# Altium schematic sheet STM32.SchDoc
size A3
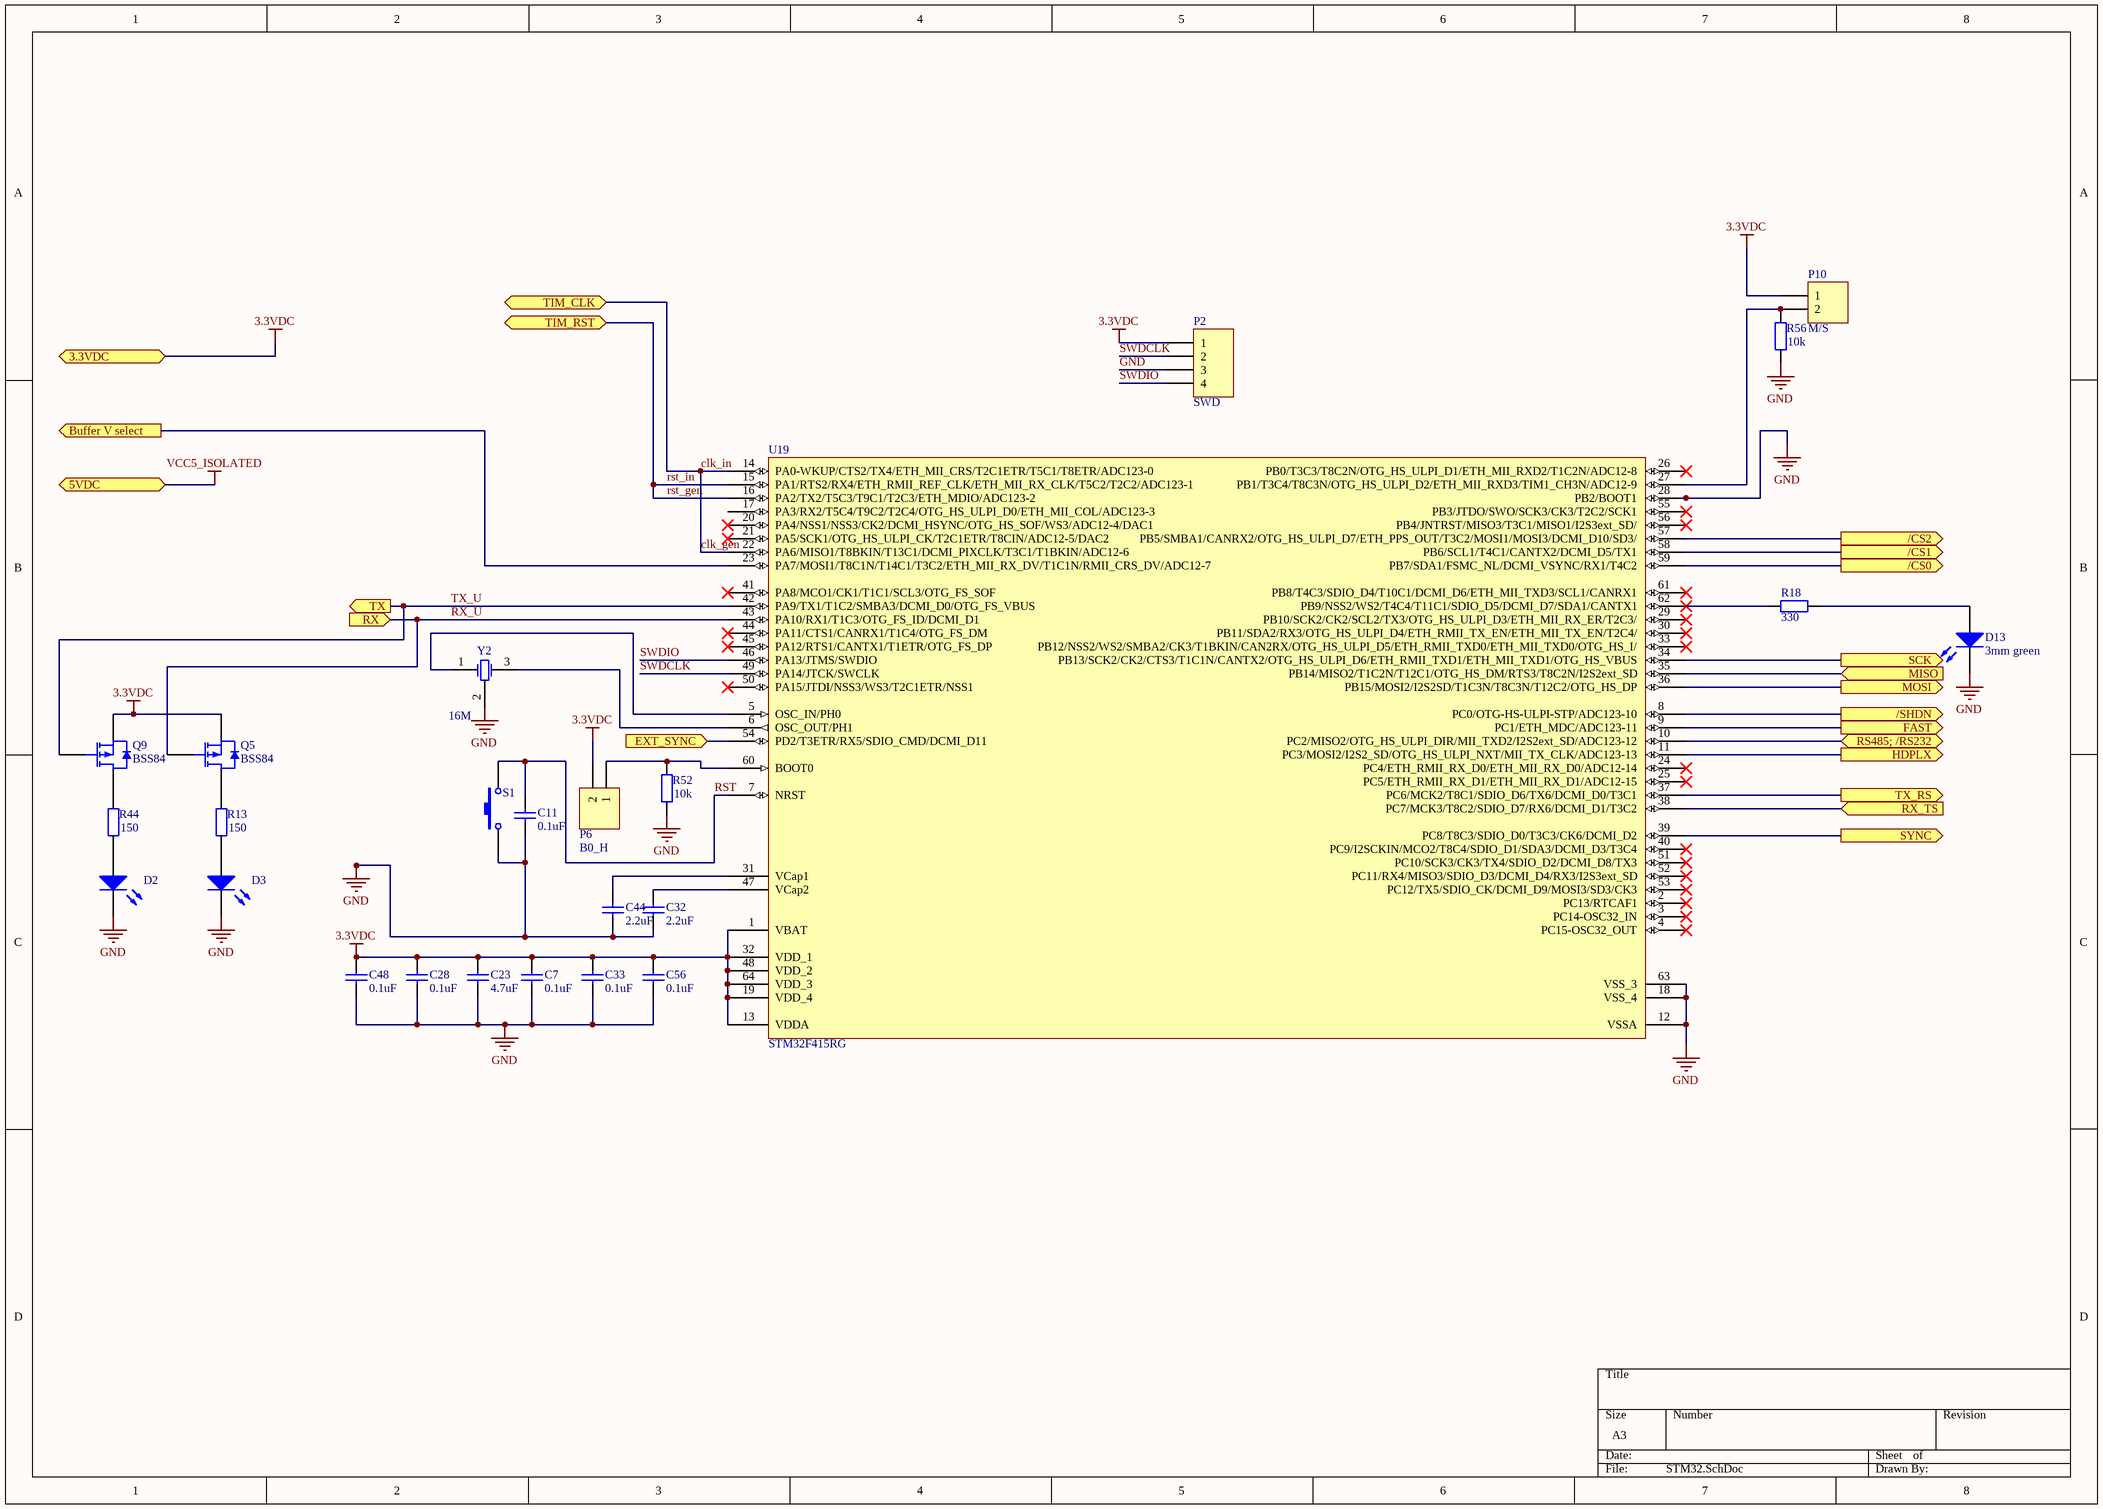
[diagram p0: STM32.SchDoc]

## Parts
C7  value 0.1uF  [C_0603]  (hidden comment: Cap)
C11  value 0.1uF  [C_0603]  (hidden comment: Cap)
C23  value 4.7uF  [C_0603]  (hidden comment: Cap)
C28  value 0.1uF  [C_0603]  (hidden comment: Cap)
C32  value 2.2uF  [C_0603]  (hidden comment: Cap)
C33  value 0.1uF  [C_0603]  (hidden comment: Cap)
C44  value 2.2uF  [C_0603]  (hidden comment: Cap)
C48  value 0.1uF  [C_0603]  (hidden comment: Cap)
C56  value 0.1uF  [C_0603]  (hidden comment: Cap)
D2  3mm led yellow  [Led, 2.54mm pitch]  (value not drawn)
D3  3mm red  [Led, 2.54mm pitch]  (value not drawn)
D13  3mm green  [Led, 2.54mm pitch]
P2  SWD  [HDR1X4]
P6  B0_H  [HDR1X2]
P10  M/S  [HDR1X2]
Q5  BSS84  [SOT23_N]
Q9  BSS84  [SOT23_N]
R13  value 150  [R_0603]  (hidden comment: Res)
R18  value 330  [R_0603]  (hidden comment: Res)
R44  value 150  [R_0603]  (hidden comment: Res)
R52  value 10k  [R_0603]  (hidden comment: Res)
R56  value 10k  [R_0603]  (hidden comment: Res)
S1  RST  [SPST_4DIP]  (value not drawn)
U19  STM32F415RG  [LQFP64]
Y2  value 16M  [XTAL16MHz]  (hidden comment: Murata XTAL)

## Ports
3.3VDC, 5VDC, /CS0 (out), /CS1 (out), /CS2 (out), /SHDN (out), Buffer V select (out), EXT_SYNC (in), FAST (out), HDPLX (out), MISO (in), MOSI (out), RS485; /RS232, RX (in), RX_TS (in), SCK (out), SYNC (out), TIM_CLK, TIM_RST, TX (out), TX_RS (out)

## Nets
3.3VDC: C7.2 C23.2 C28.2 C33.2 C48.2 C56.2 P2.1 P6.2 P10.1 Q5.2(S) Q9.2(S) U19.1(VBAT) U19.13(VDDA) U19.19(VDD_4) U19.32(VDD_1) U19.48(VDD_2) U19.64(VDD_3) ; port 3.3VDC
GND: C7.1 C11.1 C23.1 C28.1 C32.1 C33.1 C44.1 C48.1 C56.1 D2.2(K) D3.2(K) D13.2(K) P2.3 R52.1 R56.1 S1.1 U19.12(VSSA) U19.18(VSS_4) U19.28(PB2/BOOT1) U19.63(VSS_3) Y2.2
VCC5_ISOLATED: port 5VDC
/CS0: U19.59(PB7/SDA1/FSMC_NL/DCMI_VSYNC/RX1/T4C2) ; port /CS0
/CS1: U19.58(PB6/SCL1/T4C1/CANTX2/DCMI_D5/TX1) ; port /CS1
/CS2: U19.57(PB5/SMBA1/CANRX2/OTG_HS_ULPI_D7/ETH_PPS_OUT/T3C2/MOSI1/MOSI3/DCMI_D10/SD3/) ; port /CS2
/SHDN: U19.8(PC0/OTG-HS-ULPI-STP/ADC123-10) ; port /SHDN
Buffer V select: U19.23(PA7/MOSI1/T8C1N/T14C1/T3C2/ETH_MII_RX_DV/T1C1N/RMII_CRS_DV/ADC12-7) ; port Buffer V select
clk_gen: U19.14(PA0-WKUP/CTS2/TX4/ETH_MII_CRS/T2C1ETR/T5C1/T8ETR/ADC123-0) U19.22(PA6/MISO1/T8BKIN/T13C1/DCMI_PIXCLK/T3C1/T1BKIN/ADC12-6) ; port TIM_CLK  [also labelled clk_in]
EXT_SYNC: U19.54(PD2/T3ETR/RX5/SDIO_CMD/DCMI_D11) ; port EXT_SYNC
FAST: U19.9(PC1/ETH_MDC/ADC123-11) ; port FAST
HDPLX: U19.11(PC3/MOSI2/I2S2_SD/OTG_HS_ULPI_NXT/MII_TX_CLK/ADC123-13) ; port HDPLX
MISO: U19.35(PB14/MISO2/T1C2N/T12C1/OTG_HS_DM/RTS3/T8C2N/I2S2ext_SD) ; port MISO
MOSI: U19.36(PB15/MOSI2/I2S2SD/T1C3N/T8C3N/T12C2/OTG_HS_DP) ; port MOSI
RS485; /RS232: U19.10(PC2/MISO2/OTG_HS_ULPI_DIR/MII_TXD2/I2S2ext_SD/ADC123-12) ; port RS485; /RS232
RST: C11.2 S1.2 U19.7(NRST)
rst_gen: U19.15(PA1/RTS2/RX4/ETH_RMII_REF_CLK/ETH_MII_RX_CLK/T5C2/T2C2/ADC123-1) U19.16(PA2/TX2/T5C3/T9C1/T2C3/ETH_MDIO/ADC123-2) ; port TIM_RST  [also labelled rst_in]
RX_TS: U19.38(PC7/MCK3/T8C2/SDIO_D7/RX6/DCMI_D1/T3C2) ; port RX_TS
RX_U: Q5.1(G) U19.43(PA10/RX1/T1C3/OTG_FS_ID/DCMI_D1) ; port RX
SCK: U19.34(PB13/SCK2/CK2/CTS3/T1C1N/CANTX2/OTG_HS_ULPI_D6/ETH_RMII_TXD1/ETH_MII_TXD1/OTG_HS_VBUS) ; port SCK
SWDCLK: P2.2 U19.49(PA14/JTCK/SWCLK)
SWDIO: P2.4 U19.46(PA13/JTMS/SWDIO)
SYNC: U19.39(PC8/T8C3/SDIO_D0/T3C3/CK6/DCMI_D2) ; port SYNC
TX_RS: U19.37(PC6/MCK2/T8C1/SDIO_D6/TX6/DCMI_D0/T3C1) ; port TX_RS
TX_U: Q9.1(G) U19.42(PA9/TX1/T1C2/SMBA3/DCMI_D0/OTG_FS_VBUS) ; port TX
NetC32_2: C32.2 U19.47(VCap2)
NetC44_2: C44.2 U19.31(VCap1)
NetD2_1: D2.1(A) R44.1
NetD3_1: D3.1(A) R13.1
NetD13_1: D13.1(A) R18.2
NetP6_1: P6.1 R52.2 U19.60(BOOT0)
NetP10_2: P10.2 R56.2 U19.27(PB1/T3C4/T8C3N/OTG_HS_ULPI_D2/ETH_MII_RXD3/TIM1_CH3N/ADC12-9)
NetQ5_3: Q5.3(D) R13.2
NetQ9_3: Q9.3(D) R44.2
NetR18_1: R18.1 U19.62(PB9/NSS2/WS2/T4C4/T11C1/SDIO_D5/DCMI_D7/SDA1/CANTX1)
NetU19_5: U19.5(OSC_IN/PH0) Y2.1
NetU19_6: U19.6(OSC_OUT/PH1) Y2.3

Not connected (* = marked no-connect by the designer): U19 2(PC13/RTCAF1)* 3(PC14-OSC32_IN)* 4(PC15-OSC32_OUT)* 17(PA3/RX2/T5C4/T9C2/T2C4/OTG_HS_ULPI_D0/ETH_MII_COL/ADC123-3) 20(PA4/NSS1/NSS3/CK2/DCMI_HSYNC/OTG_HS_SOF/WS3/ADC12-4/DAC1)* 21(PA5/SCK1/OTG_HS_ULPI_CK/T2C1ETR/T8CIN/ADC12-5/DAC2)* 24(PC4/ETH_RMII_RX_D0/ETH_MII_RX_D0/ADC12-14)* 25(PC5/ETH_RMII_RX_D1/ETH_MII_RX_D1/ADC12-15)* 26(PB0/T3C3/T8C2N/OTG_HS_ULPI_D1/ETH_MII_RXD2/T1C2N/ADC12-8)* 29(PB10/SCK2/CK2/SCL2/TX3/OTG_HS_ULPI_D3/ETH_MII_RX_ER/T2C3/)* 30(PB11/SDA2/RX3/OTG_HS_ULPI_D4/ETH_RMII_TX_EN/ETH_MII_TX_EN/T2C4/)* 33(PB12/NSS2/WS2/SMBA2/CK3/T1BKIN/CAN2RX/OTG_HS_ULPI_D5/ETH_RMII_TXD0/ETH_MII_TXD0/OTG_HS_I/)* 40(PC9/I2SCKIN/MCO2/T8C4/SDIO_D1/SDA3/DCMI_D3/T3C4)* 41(PA8/MCO1/CK1/T1C1/SCL3/OTG_FS_SOF)* 44(PA11/CTS1/CANRX1/T1C4/OTG_FS_DM)* 45(PA12/RTS1/CANTX1/T1ETR/OTG_FS_DP)* 50(PA15/JTDI/NSS3/WS3/T2C1ETR/NSS1)* 51(PC10/SCK3/CK3/TX4/SDIO_D2/DCMI_D8/TX3)* 52(PC11/RX4/MISO3/SDIO_D3/DCMI_D4/RX3/I2S3ext_SD)* 53(PC12/TX5/SDIO_CK/DCMI_D9/MOSI3/SD3/CK3)* 55(PB3/JTDO/SWO/SCK3/CK3/T2C2/SCK1)* 56(PB4/JNTRST/MISO3/T3C1/MISO1/I2S3ext_SD/)* 61(PB8/T4C3/SDIO_D4/T10C1/DCMI_D6/ETH_MII_TXD3/SCL1/CANRX1)*

## Library data of the parts
C7 C11 C23 C28 C32 C33 C44 C48 C56 = C0603: Capacitor; Note: Footprint corresponds to dimensions for bulk cassette packaging. This case size has tightened tolerances.; Published: 17-Jul-2002; LatestRevisionDate: 19-Mar-2004; LatestRevisionNote: Silkscreen size reduced.; PackageReference: 0603; Publisher: Altium Limited; DatasheetDocument: Mar-2001; PackageDocument: Mar-2001; Code_JEITA: 0603; Code_IPC: 1608 [0603]; ComponentLink1Description: Manufacturer Link; ComponentLink1URL: http://www.kemet.com/; ComponentLink2Description: Datasheet; ComponentLink2URL: http://www.kemet.com/kemet/web/homepage/kechome.nsf/vapubfilesname/F3102TA.pdf/$file/F3102TA.pdf
D2 D3 D13 = LED0: Typical INFRARED GaAs LED; Published: 8-Jun-2000; LatestRevisionDate: 08-Jul-2005; LatestRevisionNote: Mech Layer 1 removed.; PackageReference: LED-0; Publisher: Altium Limited; PackageDescription: LED; 2 Leads
P2 = Header 4H: Header, 4-Pin, 2.54mm pitch; LatestRevisionDate: 17-Jul-2002; LatestRevisionNote: Re-released for DXP Platform.; Publisher: Altium Limited
P6 P10 = Header 2H: Header, 2-Pin, 2.54mm pitch; LatestRevisionDate: 17-Jul-2002; LatestRevisionNote: Re-released for DXP Platform.; Publisher: Altium Limited
Q5 Q9 = BSS84: P-channel Enhancement Mode Vertical D-MOSFET; Published: 17-Sep-2003; LatestRevisionDate: 12-Dec-2006; LatestRevisionNote: IPC-7351 Footprint Added.; DatasheetVersion: 18-Jun-1997; PackageVersion: May-1999; PackageReference: SOT23; Publisher: Altium Limited; PackageDescription: 3-Pin SOT-23 Package 0.95 mm Pitch, 2.3 mm Lead Span; ComponentLink1Description: Manufacturer Link; ComponentLink1URL: http://www.semiconductors.philips.com/; ComponentLink2Description: Datasheet; ComponentLink2URL: http://www.semiconductors.philips.com/acrobat/datasheets/BSS84_3.pdf
R13 R18 R44 R52 R56 = Res2: Resistor; Published: 8-Jun-2000; LatestRevisionDate: 17-Jul-2002; LatestRevisionNote: Re-released for DXP Platform.; PackageReference: AXIAL-0.4; Publisher: Altium Limited; PackageDescription: Axial Device, Thru-Hole; 2 Leads; 0.4 in Pin Spacing
S1 = SW-PB: Reset button; Published: 24-Mar-1999; LatestRevisionDate: 17-Jul-2002; LatestRevisionNote: Re-released for DXP Platform.; PackageReference: SPST-2; Publisher: Altium Limited; PackageDescription: Switch; 2 Leads
U19 = STM32F415RG: ST ARM MC; Published: 30-May-2008; DatasheetVersion: rev6, Mar-2008; PackageVersion: Mar-2008; PackageReference: LQFP64; Publisher: Altium Limited; PackageDescription: 64-Pin Low-Profile Quad Flat Pack, 10 x 10 mm Body, 0.5 mm Pitch (LQFP64); ComponentLink1Description: Manufacturer Link; ComponentLink1URL: www.st.com/stm32; ComponentLink2Description: Datasheet; ComponentLink2URL: http://www.st.com/stonline/products/literature/ds/13586.pdf
Y2 = Murata_XTAL: Murata 16 MHz XTAL